# Altium schematic sheet Controller.SchDoc
size B
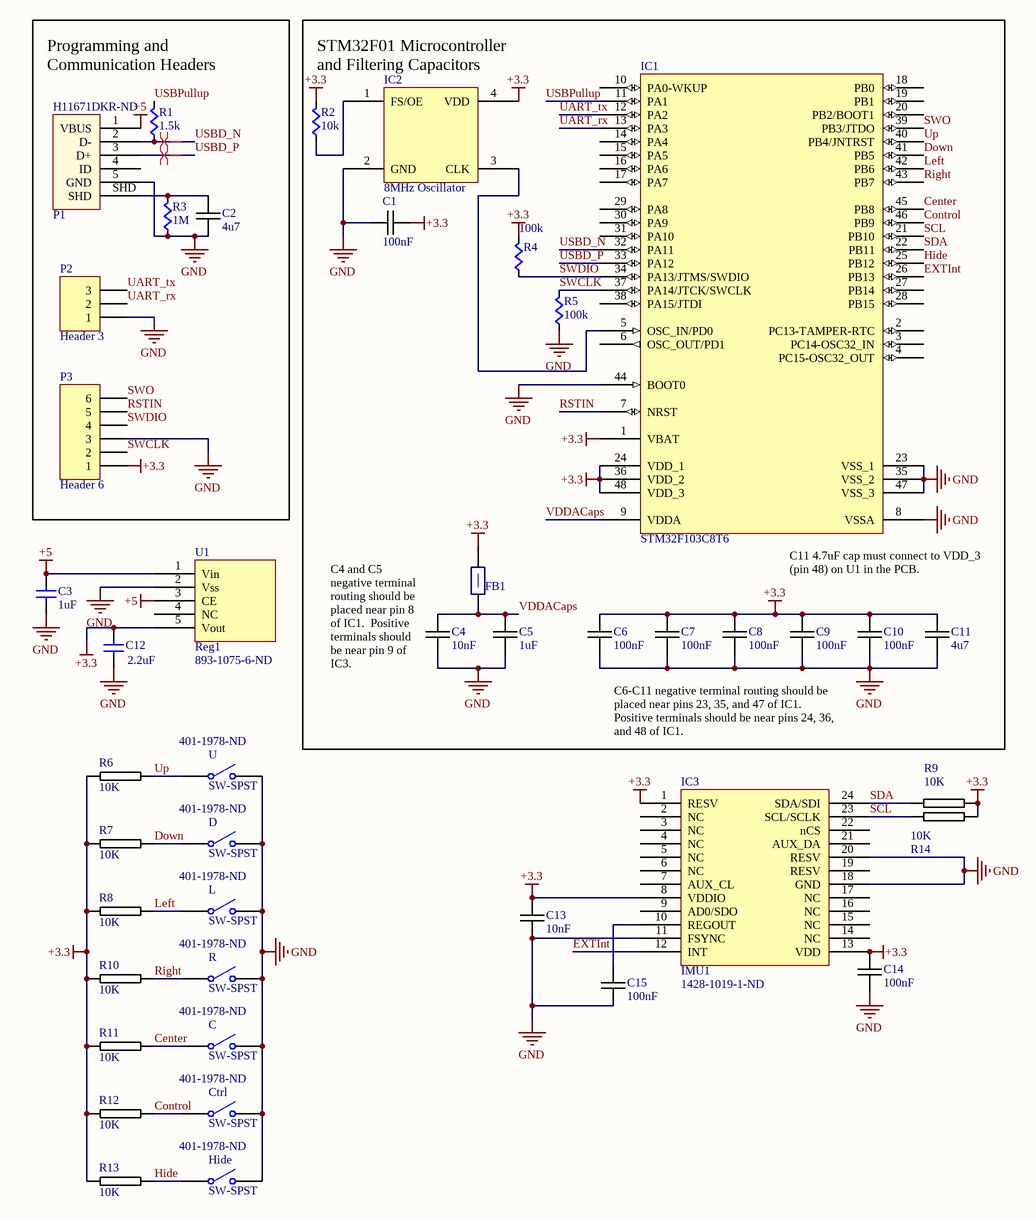
[diagram p0: Controller.SchDoc]

## Parts
C  SW-SPST  Supplier Part Number 1: 401-1978-ND  [SPST C&K D6 Switch]
C1  100nF  [0603C-GENERIC]
C2  4u7  [0603C-GENERIC]
C3  value 1uF  [CAPC0603]  (hidden comment: Cap)
C4  10nF  [0603C-GENERIC]
C5  1uF  [0603C-GENERIC]
C6  100nF  [0603C-GENERIC]
C7  100nF  [0603C-GENERIC]
C8  100nF  [0603C-GENERIC]
C9  100nF  [0603C-GENERIC]
C10  100nF  [0603C-GENERIC]
C11  4u7  [0603C-GENERIC]
C12  value 2.2uF  [CAPC0603]  (hidden comment: Cap)
C13  10nF  [0603C-GENERIC]
C14  100nF  [0603C-GENERIC]
C15  100nF  [0603C-GENERIC]
Ctrl  SW-SPST  Supplier Part Number 1: 401-1978-ND  [SPST C&K D6 Switch]
D  SW-SPST  Supplier Part Number 1: 401-1978-ND  [SPST C&K D6 Switch]
FB1  FBead  [RES0603]  (value not drawn)
Hide  SW-SPST  Supplier Part Number 1: 401-1978-ND  [SPST C&K D6 Switch]
IC1  STM32F103C8T6  [LQFP48_N]
IC2  8MHz Oscillator  [3.2 x 5 mm 4-pin DFN]
IC3  IMU1  Supplier Part Number 1: 1428-1019-1-ND  [QFN50P300X300X100-24N]
L  SW-SPST  Supplier Part Number 1: 401-1978-ND  [SPST C&K D6 Switch]
P1  Supplier Part Number 1: H11671DKR-ND  [UX60SC-MB-5ST]  (hidden comment: UX60SC-MB-5ST)
P2  Header 3  [HDR1X3]
P3  Header 6  [HDR1X6]
R  SW-SPST  Supplier Part Number 1: 401-1978-ND  [SPST C&K D6 Switch]
R1  value 1.5k  [RES0603]  (hidden comment: Res)
R2  value 10k  [RES0603]  (hidden comment: Res)
R3  value 1M  [RES0603]  (hidden comment: Res)
R4  value 100k  [RES0603]  (hidden comment: Res)
R5  value 100k  [RES0603]  (hidden comment: Res)
R6  10K  [0603R-10K]
R7  10K  [0603R-10K]
R8  10K  [0603R-10K]
R9  10K  [0603R-10K]
R10  10K  [0603R-10K]
R11  10K  [0603R-10K]
R12  10K  [0603R-10K]
R13  10K  [0603R-10K]
R14  10K  [0603R-10K]
U  SW-SPST  Supplier Part Number 1: 401-1978-ND  [SPST C&K D6 Switch]
U1  Reg1  Supplier Part Number 1: 893-1075-6-ND  [SOT-25]

## Nets
+3.3: C1.2 C6.1 C7.1 C8.1 C9.1 C10.1 C11.1 C12.1(A) C13.2 C14.1 FB1.2(B) IC1.1(VBAT) IC1.24(VDD_1) IC1.36(VDD_2) IC1.48(VDD_3) IC2.4(VDD) IC3.1(RESV) IC3.8(VDDIO) IC3.13(VDD) P3.1 R2.1(A) R4.1(A) R6.1 R7.1 R8.1 R9.2 R10.1 R11.1 R12.1 R13.1 R14.2 U1.5(Vout)
+5: C3.1(A) P1.1(VBUS) U1.1(Vin) U1.3(CE)
GND: C.2(NO) C1.1 C2.2 C3.2(B) C4.2 C5.2 C6.2 C7.2 C8.2 C9.2 C10.2 C11.2 C12.2(B) C13.1 C14.2 C15.2 Ctrl.2(NO) D.2(NO) Hide.2(NO) IC1.8(VSSA) IC1.23(VSS_1) IC1.35(VSS_2) IC1.44(BOOT0) IC1.47(VSS_3) IC2.2(GND) IC3.11(FSYNC) IC3.18(GND) IC3.20(RESV) L.2(NO) P1.5(GND) P2.1 P3.3 R.2(NO) R3.2(B) R5.2(B) U.2(NO) U1.2(Vss)
Center: C.1(COMMON) IC1.45(PB8) R11.2
Control: Ctrl.1(COMMON) IC1.46(PB9) R12.2
Down: D.1(COMMON) IC1.41(PB5) R7.2
EXTInt: IC1.26(PB13) IC3.12(INT)
Hide: Hide.1(COMMON) IC1.25(PB12) R13.2
Left: IC1.42(PB6) L.1(COMMON) R8.2
Right: IC1.43(PB7) R.1(COMMON) R10.2
RSTIN: IC1.7(NRST) P3.5
SCL: IC1.21(PB10) IC3.23(SCL/SCLK) R14.1
SDA: IC1.22(PB11) IC3.24(SDA/SDI) R9.1
SWCLK: IC1.37(PA14/JTCK/SWCLK) P3.2 R5.1(A)
SWDIO: IC1.34(PA13/JTMS/SWDIO) P3.4 R4.2(B)
SWO: IC1.39(PB3/JTDO) P3.6
UART_rx: IC1.13(PA3) P2.2
UART_tx: IC1.12(PA2) P2.3
Up: IC1.40(PB4/JNTRST) R6.2 U.1(COMMON)
USBD_N: IC1.32(PA11) P1.2(D-) R1.2(B)
USBD_P: IC1.33(PA12) P1.3(D+)
USBPullup: IC1.11(PA1) R1.1(A)
VDDACaps: C4.1 C5.1 FB1.1(A) IC1.9(VDDA)
NetC2_1: C2.1 P1.SHD R3.1(A)
NetC15_1: C15.1 IC3.10(REGOUT)
NetIC1_5: IC1.5(OSC_IN/PD0) IC2.3(CLK)
NetIC2_1: IC2.1(FS/OE) R2.2(B)

Not connected (* = marked no-connect by the designer): IC1 2(PC13-TAMPER-RTC) 3(PC14-OSC32_IN) 4(PC15-OSC32_OUT) 6(OSC_OUT/PD1) 10(PA0-WKUP) 14(PA4) 15(PA5) 16(PA6) 17(PA7) 18(PB0) 19(PB1) 20(PB2/BOOT1) 27(PB14) 28(PB15) 29(PA8) 30(PA9) 31(PA10) 38(PA15/JTDI); IC3 2(NC) 3(NC) 4(NC) 5(NC) 6(NC) 7(AUX_CL) 9(AD0/SDO) 14(NC) 15(NC) 16(NC) 17(NC) 19(RESV) 21(AUX_DA) 22(nCS); P1 4(ID); U1 4(NC)

## Layout directives
differential pair: USBD_N, USBD_P

## Notes on the sheet
- Programming and Communication Headers
- STM32F01 Microcontroller and Filtering Capacitors
- (near IC1) C11 4.7uF cap must connect to VDD_3 (pin 48) on U1 in the PCB.
- (near C4) C4 and C5 negative terminal routing should be placed near pin 8 of IC1.  Positive terminals should be near pin 9 of IC3.
- C6-C11 negative terminal routing should be placed near pins 23, 35, and 47 of IC1.  Positive terminals should be near pins 24, 36, and 48 of IC1.

## Library data of the parts
C Ctrl D Hide L R U = SW-SPST: Single-Pole, Single-Throw Switch; Published: 24-Mar-1999; LatestRevisionDate: 17-Jul-2002; LatestRevisionNote: Re-released for DXP Platform.; PackageReference: SPST-2; Publisher: Altium Limited; PackageDescription: Switch; 2 Leads; Supplier 1: Digi-Key
C1 = 0603C-100NF-25V-X7R-TDK: CAPACITOR 0603 CERAMIC; Manufacturer: TDK Corporation; Reel: C12; Description: CAP CER .10UF 25V X7R 10% 0603; Supplier 1: Digi-Key; Supplier Part Number 1: 445-1316-1-ND
C2 C11 = 0603C-4U7-10V-X5R-TDK: CAPACITOR 0603 CERAMIC; Manufacturer Part Number: C1608X5R1A475K; Manufacturer: TDK Corporation; Reel: C13; Temperature Coefficient: X5R; Description: CAP CER 4.7UF 10V X5R 0603; Voltage - Rated: 10V; Capacitance: 4.7µF; Tolerance: ±10%; Mounting Type: Surface Mount, MLCC; Operating Temperature: -55°C ~ 85°C; Features: General Purpose; Lead Spacing: -; Package / Case: 0603 (1608 metric); Thickness: 0.80mm; Packaging: Tape & Reel (TR); Category: Capacitors; Supplier: Digi-Key; RoHS: RoHS Compliant; Supplier 1: Digi-Key
  C2: Supplier Part Number 1: 445-5170-6-ND
  C11: Supplier Part Number 1: 445-5170-2-ND; Supplier Part Number: 445-5170-2-ND
C4 C13 = 0603C-10NF-50V-X7R-MUR: CAPACITOR 0603 CERAMIC; Manufacturer Part Number: GRM188R71H103KA01D; Manufacturer: Murata Electronics North America; Reel: C22; Description: CAP CER 10000PF 50V 10% X7R 0603; Supplier 1: Digi-Key; Supplier Part Number 1: 490-1512-2-ND
C5 = 0603C-1UF-25V-X5R-SAM: CAPACITOR 0603 CERAMIC; Reel: C17; Supplier 1: Digi-Key; Supplier Part Number 1: 1276-1946-6-ND
C6-C10 = 0603C-100NF-50V-X7R-TDK: CAPACITOR 0603 CERAMIC; Manufacturer: TDK Corporation; Temperature Coefficient: X7R; Tolerance: ±10%; Voltage - Rated: 50V; Capacitance: 10000pF; Description: CAP CER 10000PF 50V X7R 10% 0603; Reel: C68; RoHS: RoHS Compliant; Lead Spacing: -; Package / Case: 0603 (1608 metric); Features: General Purpose; Packaging: Tape & Reel (TR); Thickness: 0.80mm; Operating Temperature: -55°C ~ 125°C; Mounting Type: Surface Mount, MLCC; Category: Capacitors; Supplier 1: Digi-Key; Supplier Part Number 1: 445-1316-1-ND
C14 C15 = 0603C-100NF-25V-X7R-TDK: CAPACITOR 0603 CERAMIC; Manufacturer Part Number: C1608X7R1E104K; Manufacturer: TDK Corporation; Reel: C12; Description: CAP CER .10UF 25V X7R 10% 0603; Supplier 1: Digi-Key; Supplier Part Number 1: 445-1316-2-ND
FB1 = FBead: Ferrite Bead; Supplier 1: Digi-Key; Supplier Part Number 1: 445-2988-6-ND
IC1 = STM32F103C8T6: STM32 ARM-based 32-bit MCU with 64 Kbytes Flash, 48-pin LQFP, Industrial Temperature; Published: 30-May-2008; DatasheetVersion: rev6, Mar-2008; PackageVersion: Mar-2008; PackageReference: LQFP48; Publisher: Altium Limited; PackageDescription: 48-Pin Low-Profile Quad Flat Pack, 7 x 7 mm Body, 0.5 mm Pitch (LQFP48); ComponentLink1Description: Manufacturer Link; ComponentLink1URL: www.st.com/stm32; ComponentLink2Description: Datasheet; ComponentLink2URL: http://www.st.com/stonline/products/literature/ds/13587.pdf; Supplier 1: Digi-Key; Supplier Part Number 1: 497-6063-ND
IC2 = Si501 Oscillator: Oscillator; Supplier 1: Digi-Key; Supplier Part Number 1: 336-2872-ND
IC3 = MPU9250: 9-DOF IMU; Supplier 1: Digi-Key
P1 = UX60SC-MB-5ST: USB Mini B Metal Shield SMT; Supplier 1: Digi-Key
P2 = Header 3: Header, 3-Pin; LatestRevisionDate: 17-Jul-2002; LatestRevisionNote: Re-released for DXP Platform.; Publisher: Altium Limited
P3 = Header 6: Header, 6-Pin; LatestRevisionDate: 17-Jul-2002; LatestRevisionNote: Re-released for DXP Platform.; Publisher: Altium Limited; Supplier 1: Digi-Key; Supplier Part Number 1: A26509-40-ND
R6-R14 = 0603R-10K: GENERIC RESISTOR 0603; Manufacturer: Stackpole Electronics Inc; Manufacturer Part Number: RMCF 1/16 10K 1% R; Tolerance: ±1%; Power (Watts): 0.1W, 1/10W; Temperature Coefficient: ±100ppm/°C; Description: RES 10K OHM 1/10W 1% 0603 SMD; Resistance In Ohms: 10.0K; Reel: R21; Category: Resistors; Supplier Part Number: RMCF1/1610KFRDKR-ND; Lead Style: Surface Mount (SMD - SMT); RoHS: RoHS Compliant; Packaging: Digi-Reel®; Case: 0603 (1608 metric); Composition: Thick Film; Supplier: Digi-Key; Supplier 1: Digi-Key; Supplier Part Number 1: RMCF0603FT10K0DKR-ND
U1 = 3VRegulator: Voltage Regulator; Supplier 1: Digi-Key
C3 C12 = Cap: Supplier 1: Digi-Key
  C3: Supplier Part Number 1: 1276-1946-1-ND
  C12: Supplier Part Number 1: 587-1254-1-ND
R1-R5 = Res: Supplier 1: Digi-Key
  R1: Supplier Part Number 1: RHM1.50KCFDKR-ND
  R2: Supplier Part Number 1: RMCF0603JT10K0CT-ND; Supplier 2: Digi-Key; Supplier Part Number 2: P10KGDKR-ND
  R3: Supplier Part Number 1: P1.00MHTR-ND
  R4 R5: Supplier Part Number 1: P100KGTR-ND